# EAGLE schematic stereo_link (EAGLE 7.3.0)
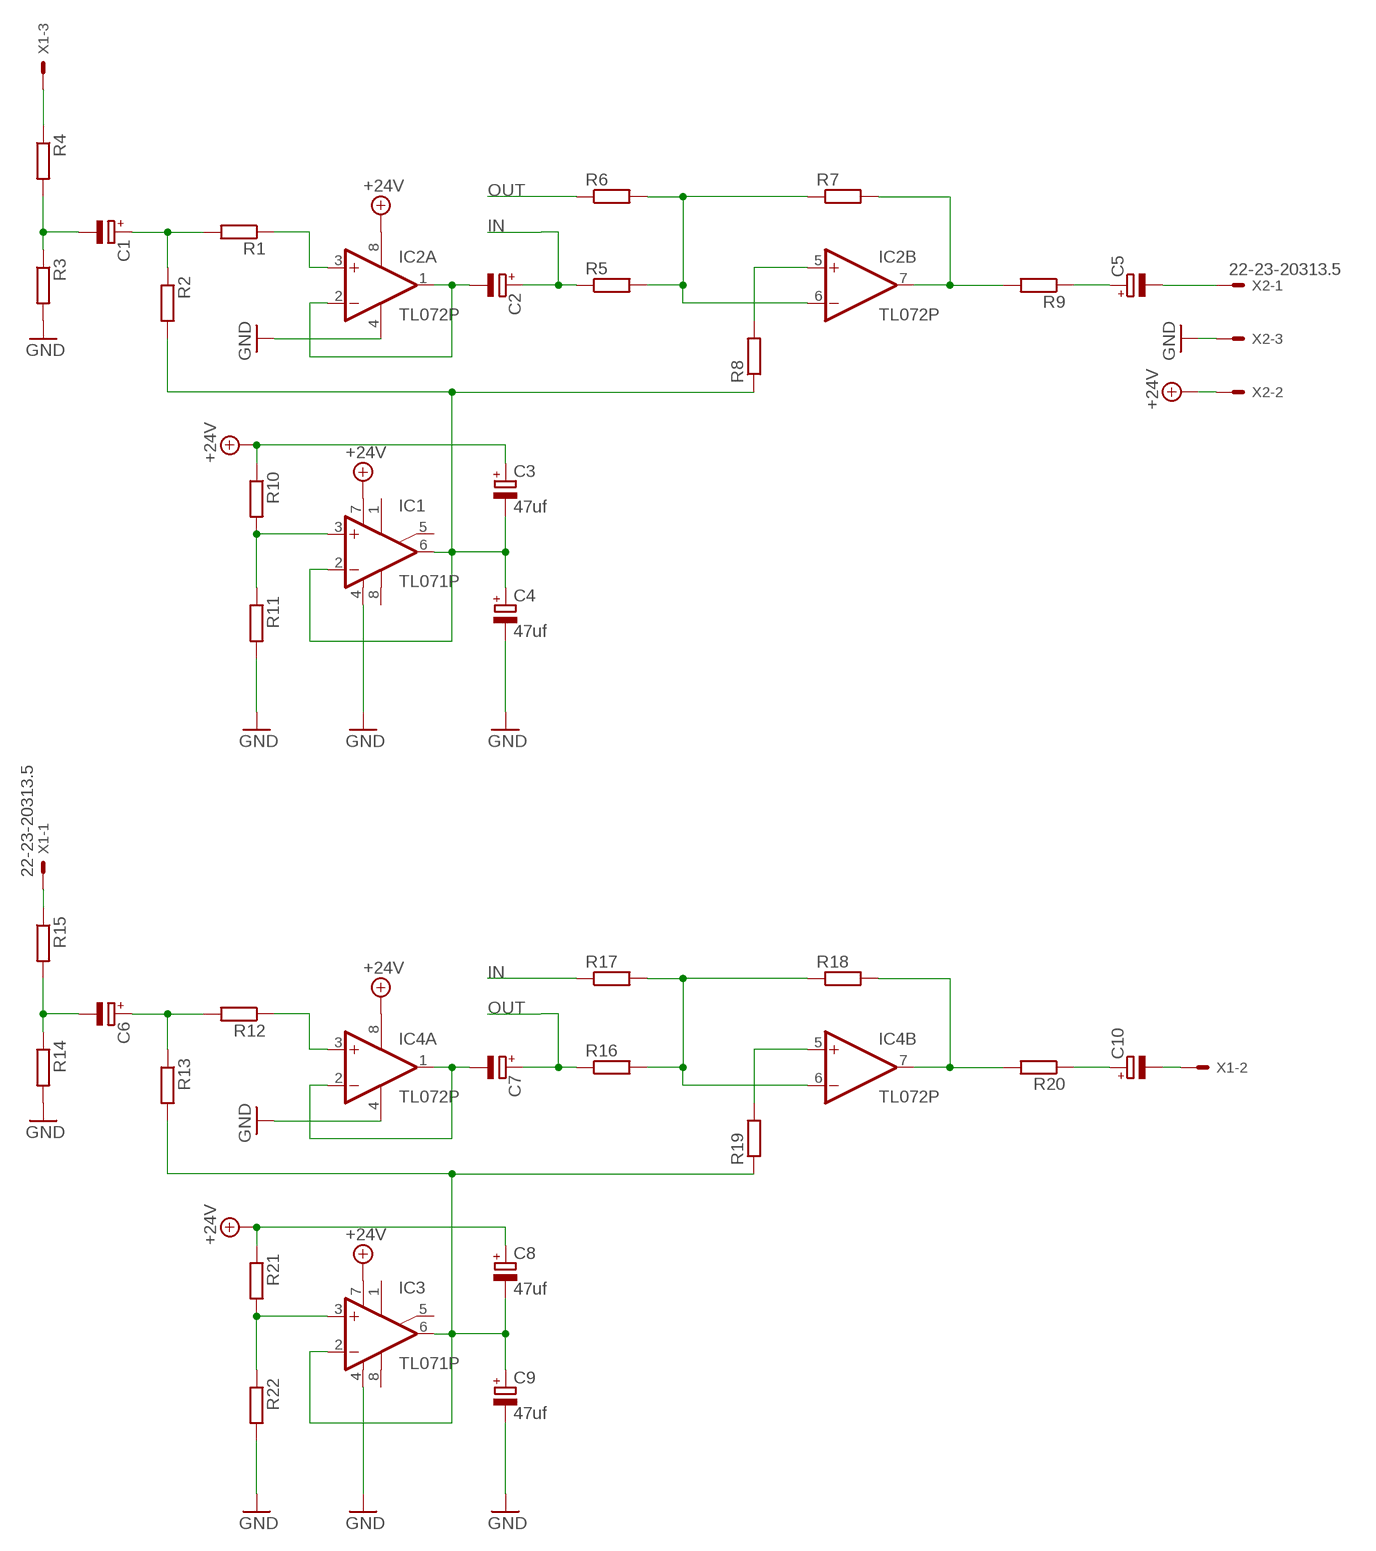
[diagram p0: schematic, sheet 1]

## Parts
C1  CPOL-EUE1.8-4  [E1,8-4]
C2  CPOL-EUE1.8-4  [E1,8-4]
C3  47uf  CPOL-EUE2,5-6E  [E2,5-6E]
C4  47uf  CPOL-EUE2,5-6E  [E2,5-6E]
C5  CPOL-EUE1.8-4  [E1,8-4]
C6  CPOL-EUE1.8-4  [E1,8-4]
C7  CPOL-EUE1.8-4  [E1,8-4]
C8  47uf  CPOL-EUE2,5-6E  [E2,5-6E]
C9  47uf  CPOL-EUE2,5-6E  [E2,5-6E]
C10  CPOL-EUE1.8-4  [E1,8-4]
IC1  TL071P  [DIL08]
IC2  TL072P  [DIL08]
IC3  TL071P  [DIL08]
IC4  TL072P  [DIL08]
R1  R-EU_0204/7  [0204/7]
R2  R-EU_0204/7  [0204/7]
R3  R-EU_0204/7  [0204/7]
R4  R-EU_0204/7  [0204/7]
R5  R-EU_0204/7  [0204/7]
R6  R-EU_0204/7  [0204/7]
R7  R-EU_0204/7  [0204/7]
R8  R-EU_0204/7  [0204/7]
R9  R-EU_0204/7  [0204/7]
R10  R-EU_0204/7  [0204/7]
R11  R-EU_0204/7  [0204/7]
R12  R-EU_0204/7  [0204/7]
R13  R-EU_0204/7  [0204/7]
R14  R-EU_0204/7  [0204/7]
R15  R-EU_0204/7  [0204/7]
R16  R-EU_0204/7  [0204/7]
R17  R-EU_0204/7  [0204/7]
R18  R-EU_0204/7  [0204/7]
R19  R-EU_0204/7  [0204/7]
R20  R-EU_0204/7  [0204/7]
R21  R-EU_0204/7  [0204/7]
R22  R-EU_0204/7  [0204/7]
X1  22-23-20313.5  [3.5MM]
X2  22-23-20313.5  [3.5MM]

## Nets
+24V: C3.+ C8.+ IC1.7(V+) IC2.8(P:V+) IC3.7(V+) IC4.8(P:V+) R10.1 R21.1 X2.P$2
GND: C4.- C9.- IC1.4(V-) IC2.4(P:V-) IC3.4(V-) IC4.4(P:V-) R3.2 R11.2 R14.2 R22.2 X2.P$3
IN: C2.+ R5.1 R17.1
N$1: C1.- R3.1 R4.2
N$2: C1.+ R1.2 R2.1
N$3: C6.- R14.1 R15.2
N$4: IC2.3(A:+IN) R1.1
N$5: C2.- IC2.1(A:OUT) IC2.2(A:-IN)
N$6: R15.1 X1.P$1
N$8: IC2.6(B:-IN) R5.2 R6.2 R7.1
N$9: IC2.5(B:+IN) R8.2
N$10: IC2.7(B:OUT) R7.2 R9.2
N$11: C5.+ R9.1
N$12: C5.- X2.P$1
N$13: IC1.3(+IN) R10.2 R11.1
N$14: C10.- X1.P$2
N$15: C6.+ R12.2 R13.1
N$16: IC4.3(A:+IN) R12.1
N$17: C3.- C4.+ IC1.2(-IN) IC1.6(OUT) R2.2 R8.1
N$18: C7.- IC4.1(A:OUT) IC4.2(A:-IN)
N$19: R4.1 X1.P$3
N$21: IC4.6(B:-IN) R16.2 R17.2 R18.1
N$22: IC4.5(B:+IN) R19.2
N$23: IC4.7(B:OUT) R18.2 R20.2
N$24: C10.+ R20.1
N$26: IC3.3(+IN) R21.2 R22.1
N$27: C8.- C9.+ IC3.2(-IN) IC3.6(OUT) R13.2 R19.1
OUT: C7.+ R6.1 R16.1
Unconnected: IC1.1(ON1) IC1.5(ON2) IC1.8(OPT) IC3.1(ON1) IC3.5(ON2) IC3.8(OPT)

## Library data of the parts
C1-C10 = rcl:CPOL-EU: POLARIZED CAPACITOR, European symbol
IC1 IC3 = linear:TL071: OP AMP
IC2 IC4 = linear:TL072: OP AMP
R1-R22 = rcl:R-EU_: RESISTOR, European symbol
X1 X2 = con-molex:22-23-2031: .100" (2.54mm) Center Header - 3 Pin